# EAGLE design eCog108_Keyfob (EAGLE 6.6.0)
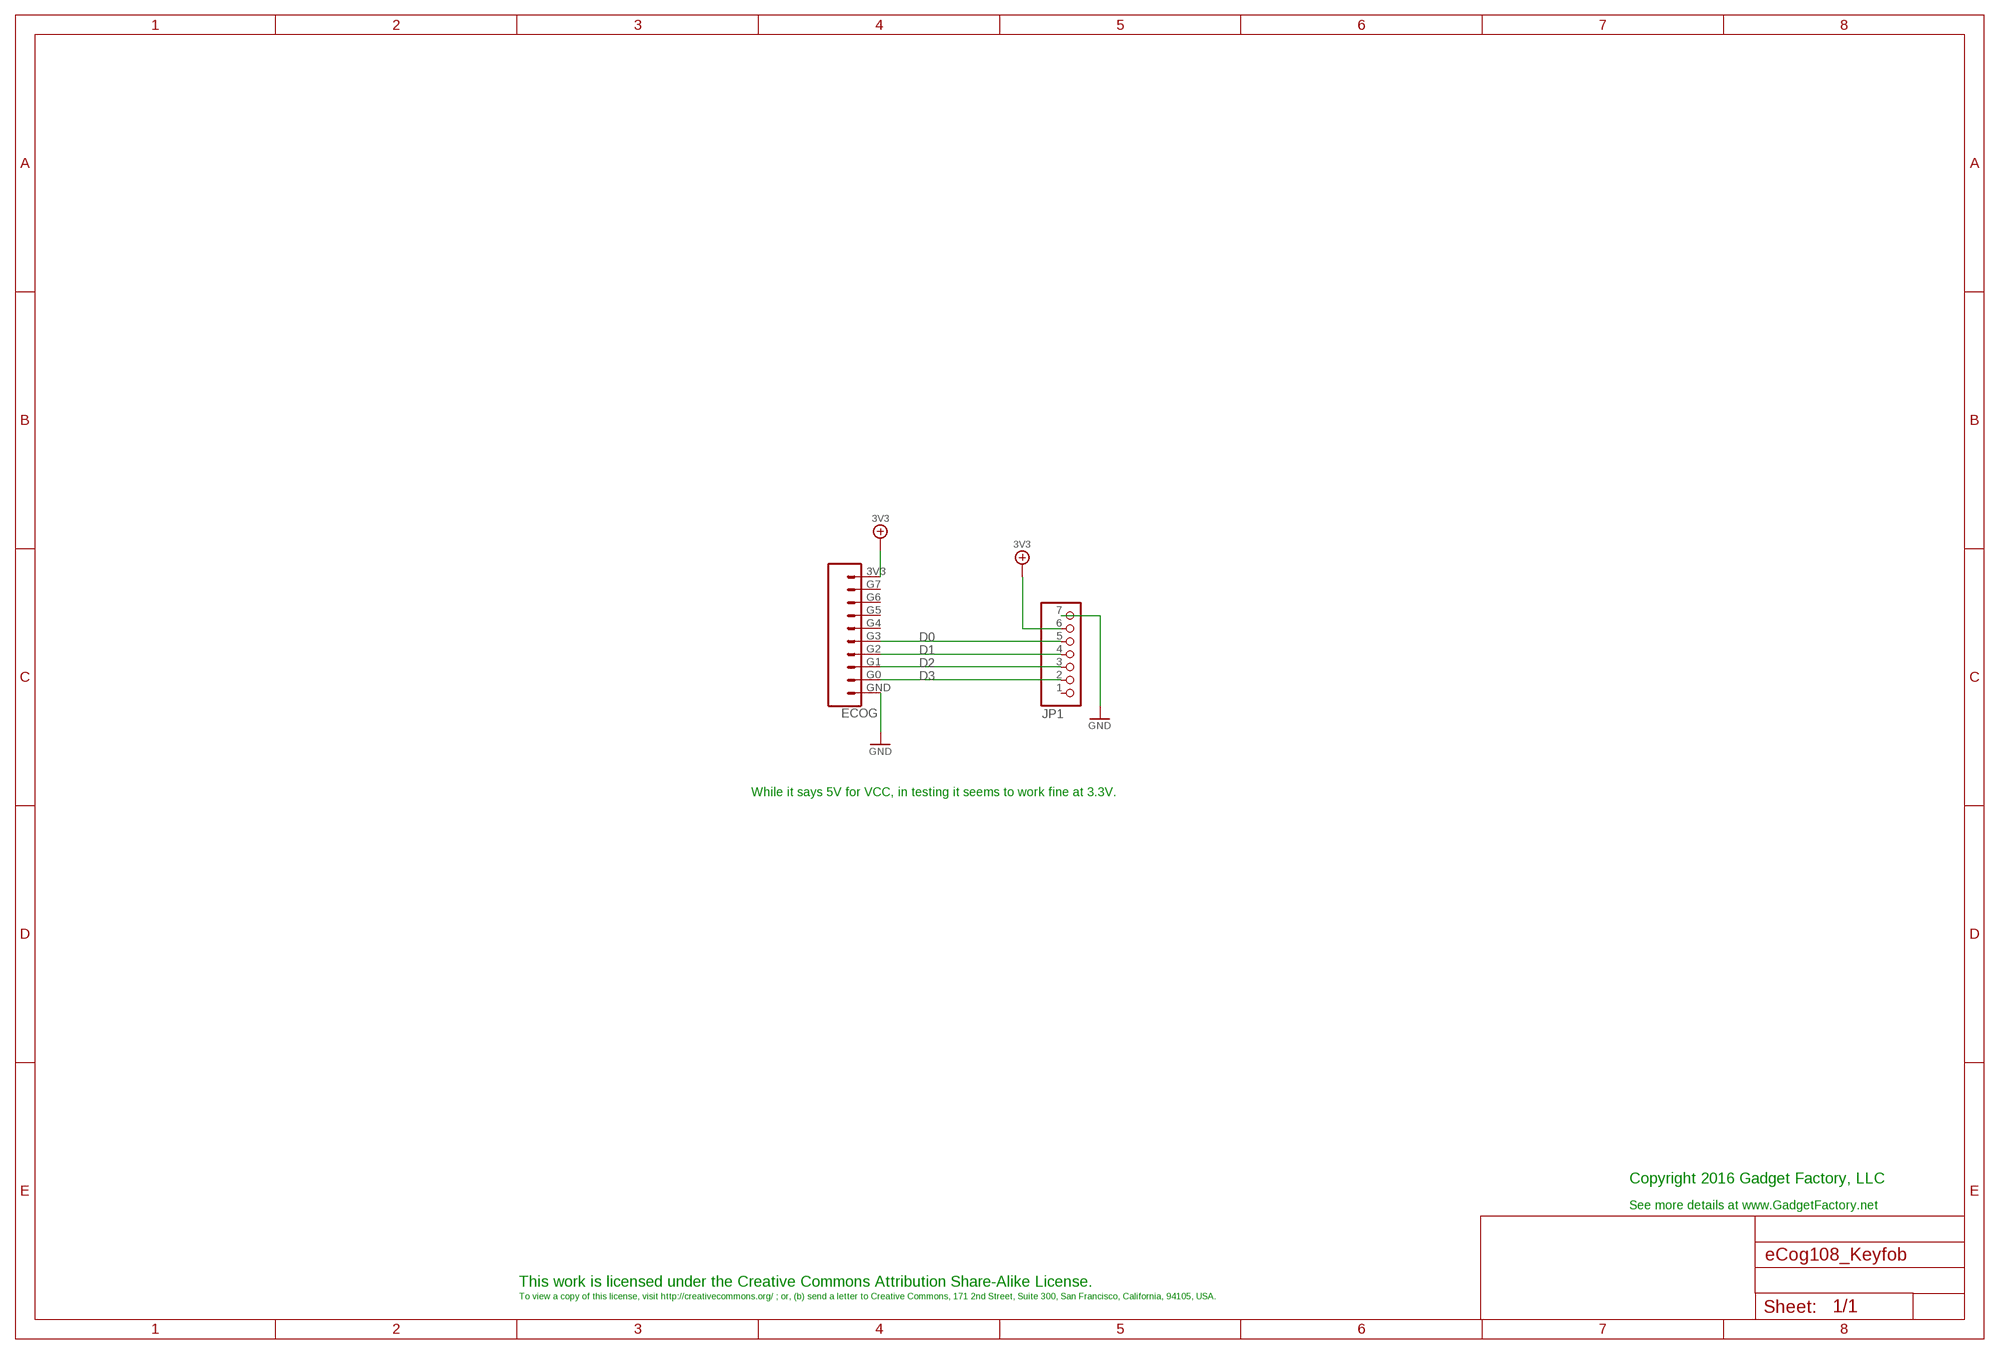
[diagram p0: schematic, sheet 1]

## Parts
ECOG  ECOG_GENERAL_ROWECOG_GENERAL_SMD  [ECOG_GENERAL_SMD]
JP1  PINHD-1X7  [1X07]

## Nets
3V3: ECOG.3V3 JP1.6
D0: ECOG.G3 JP1.5
D1: ECOG.G2 JP1.4
D2: ECOG.G1 JP1.3
D3: ECOG.G0 JP1.2
GND: ECOG.GND JP1.7
Unconnected: ECOG.G4 ECOG.G5 ECOG.G6 ECOG.G7 JP1.1

## Notes on the sheet
- While it says 5V for VCC, in testing it seems to work fine at 3.3V.
- Copyright 2016 Gadget Factory, LLC
- See more details at www.GadgetFactory.net
- This work is licensed under the Creative Commons Attribution Share-Alike License.
- To view a copy of this license, visit http://creativecommons.org/ ; or, (b) send a letter to Creative Commons, 171 2nd Street, Suite 300, San Francisco, California, 94105, USA.

## Library data of the parts
ECOG = eCogs:ECOG_GENERAL_ROW; DIGIKEY: S1013EC-10-ND
JP1 = pinhead:PINHD-1X7: PIN HEADER

## Board
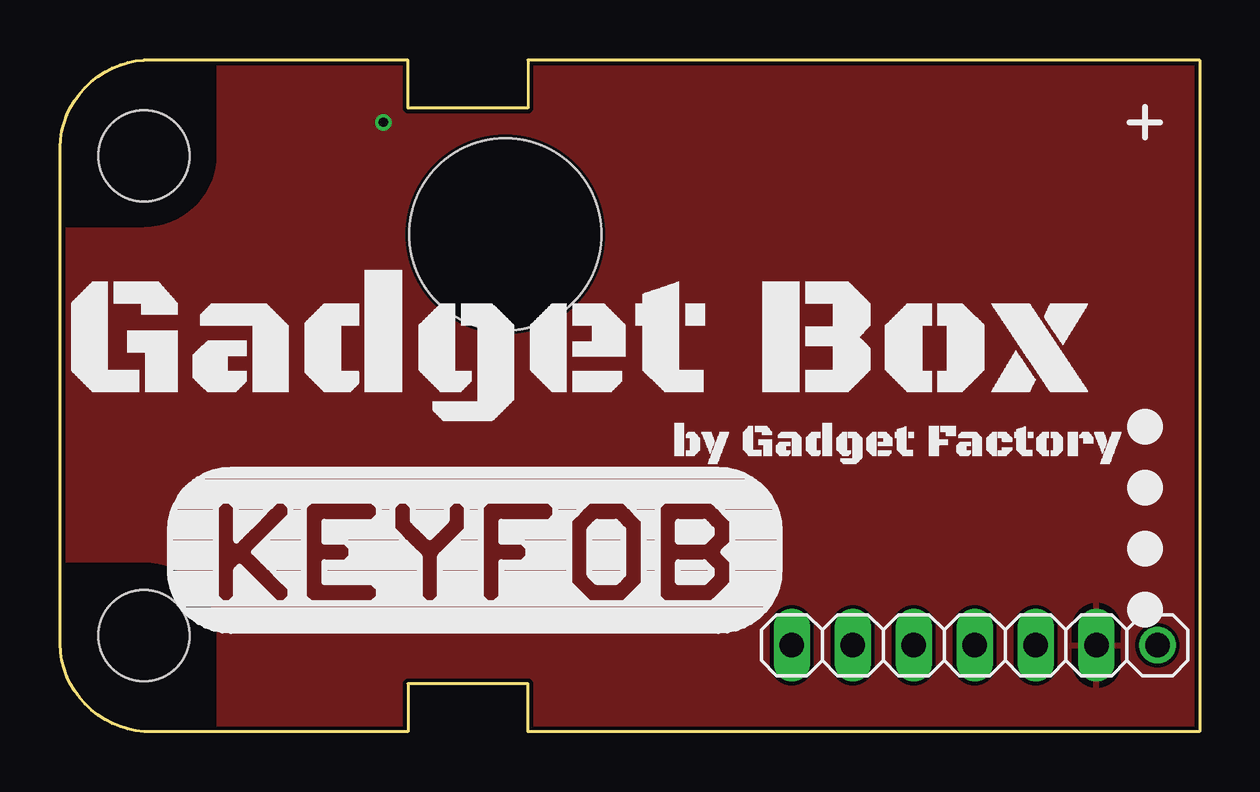
[diagram p1: board, top side]
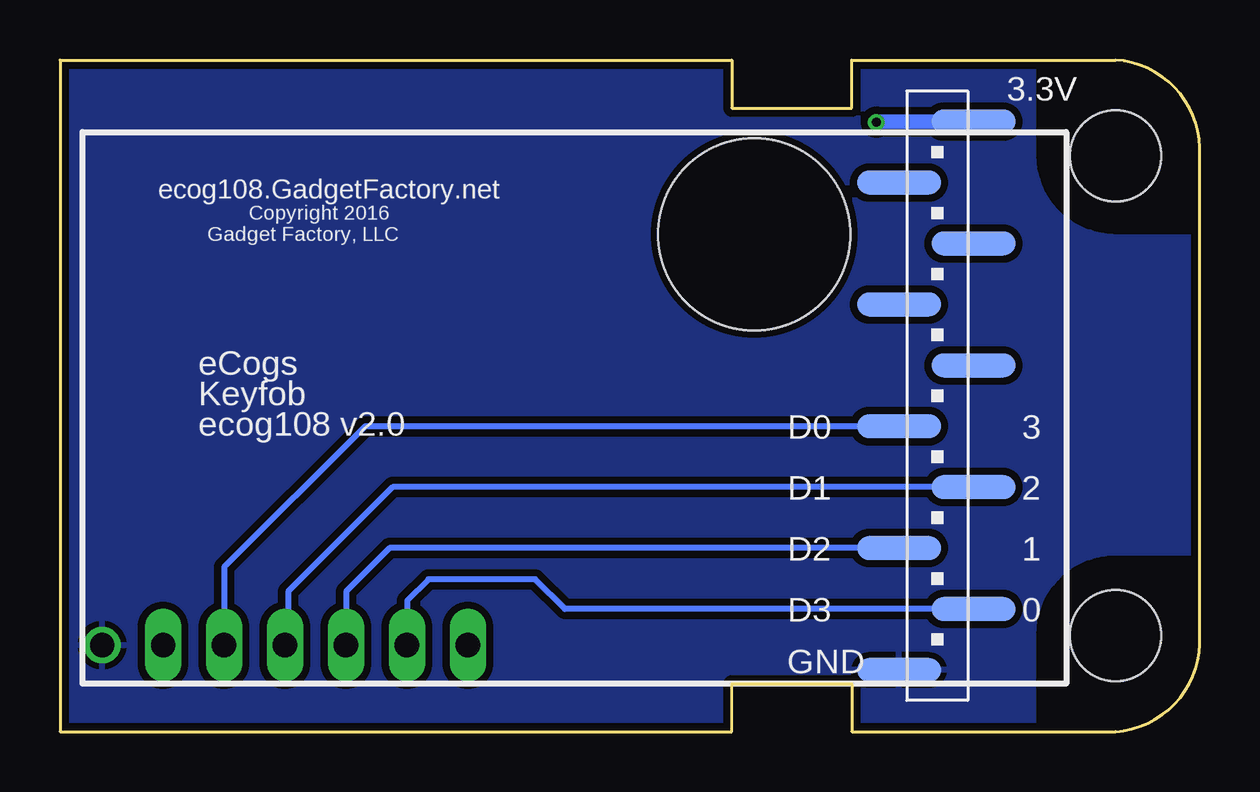
[diagram p2: board, bottom side, seen from below]

Size 47.51 x 28 mm. Coordinates in mm from the lower left corner, seen from the top.
Copper layers (1*16): Top 0.035mm / dielectric 1.5mm / Bottom 0.035mm
Design rules "hackvana *": minimum track width 6mil, minimum drill 0.3mm, track to track 6mil, track to pad 6mil, pad to pad 6mil, via to via 6mil, smd to smd 0mil, copper to edge 6mil, drill to drill 6mil, minimum pad ring 10mil, minimum via ring 6mil, stop-mask expansion 2mil, vias tented up to drill 100mil, thermal gap 10mil
Holes 8 mm at 18.57,20.73

### Footprints (pad centres in the part's own frame; a part is rotated, then mirrored left to right if it is on the bottom)
ECOG_GENERAL_SMD = smd 3.5 x 1 bottom: 3V3 9.923,25.429; G0 9.923,5.111; G1 13.022,7.649; G2 9.923,10.189; G3 13.022,12.729; G4 9.923,15.269; G5 13.022,17.809; G6 9.923,20.349; G7 13.022,22.889; GND 13.022,2.571 | hole 3.8: 4,24; 4,4
1X07 = drill 1.016 long: 1 -7.62,0; 2 -5.08,0; 3 -2.54,0; 4 0,0; 5 2.54,0; 6 5.08,0 | drill 1.016: 7 7.62,0

### Placement (x,y rotation side)
ECOG  -0.49,0 0 top
JP1  38.13,3.6 0 top
U$1  [GADGETBOX_TEXT]  21.73,15.88 0 top
U$2  [LEGEND_DIO]  45.23,12.7 0 top
U$3  [LEGEND_DIO]  45.23,10.16 0 top
U$4  [LEGEND_DIO]  45.23,7.62 0 top
U$5  [LEGEND_DIO]  45.23,5.08 0 top

### Tracks (layer width: path | path; a pad name or v marks a point on that pad's centre or on a via)
3V3  (via drill 0.38)
  Bottom 0.61: ECOG.3V3 13.45,25.43 v13.48,25.4
  pour Top: -1.49,29 48.51,29 48.51,-1 -1.49,-1
D0
  Bottom 0.254: ECOG.G3 34.78,12.73 40.66,6.86 40.66,3.61 JP1.5
D1
  Bottom 0.254: ECOG.G2 33.64,10.19 37.99,5.84 37.99,3.74 JP1.4
D2
  Bottom 0.254: ECOG.G1 33.77,7.65 35.58,5.84 35.58,3.61 JP1.3
D3
  Bottom 0.254: ECOG.G0 26.46,5.11 27.7,6.35 32.15,6.35 33.04,5.46 33.04,3.61 JP1.2
GND
  pour Bottom (isolate 0.305): -2.49,30 49.51,30 49.51,-2 -2.49,-2

### Text on the board
bPlace: 3.3V | ecog108.GadgetFactory.net | Copyright 2016 | Gadget Factory, LLC | eCogs | Keyfob | 3 | D0 | ecog108 v2.0 | 2 | D1 | 1 | D2 | 0 | D3 | GND